# Altium schematic sheet Amp_op3.SchDoc: AmpOps de Potência
size A3; Address1: UFCG; Address2: Laboratório VIRTUS CC; Address3: Campina Grande, PB - Brasil; SheetNumber: 5; SheetTotal: 7; DocumentRev: 01; Project: HAT RPi 4 - Phase Shifter Fotônico; SCH_SCALE: N/A; Version: v1.0
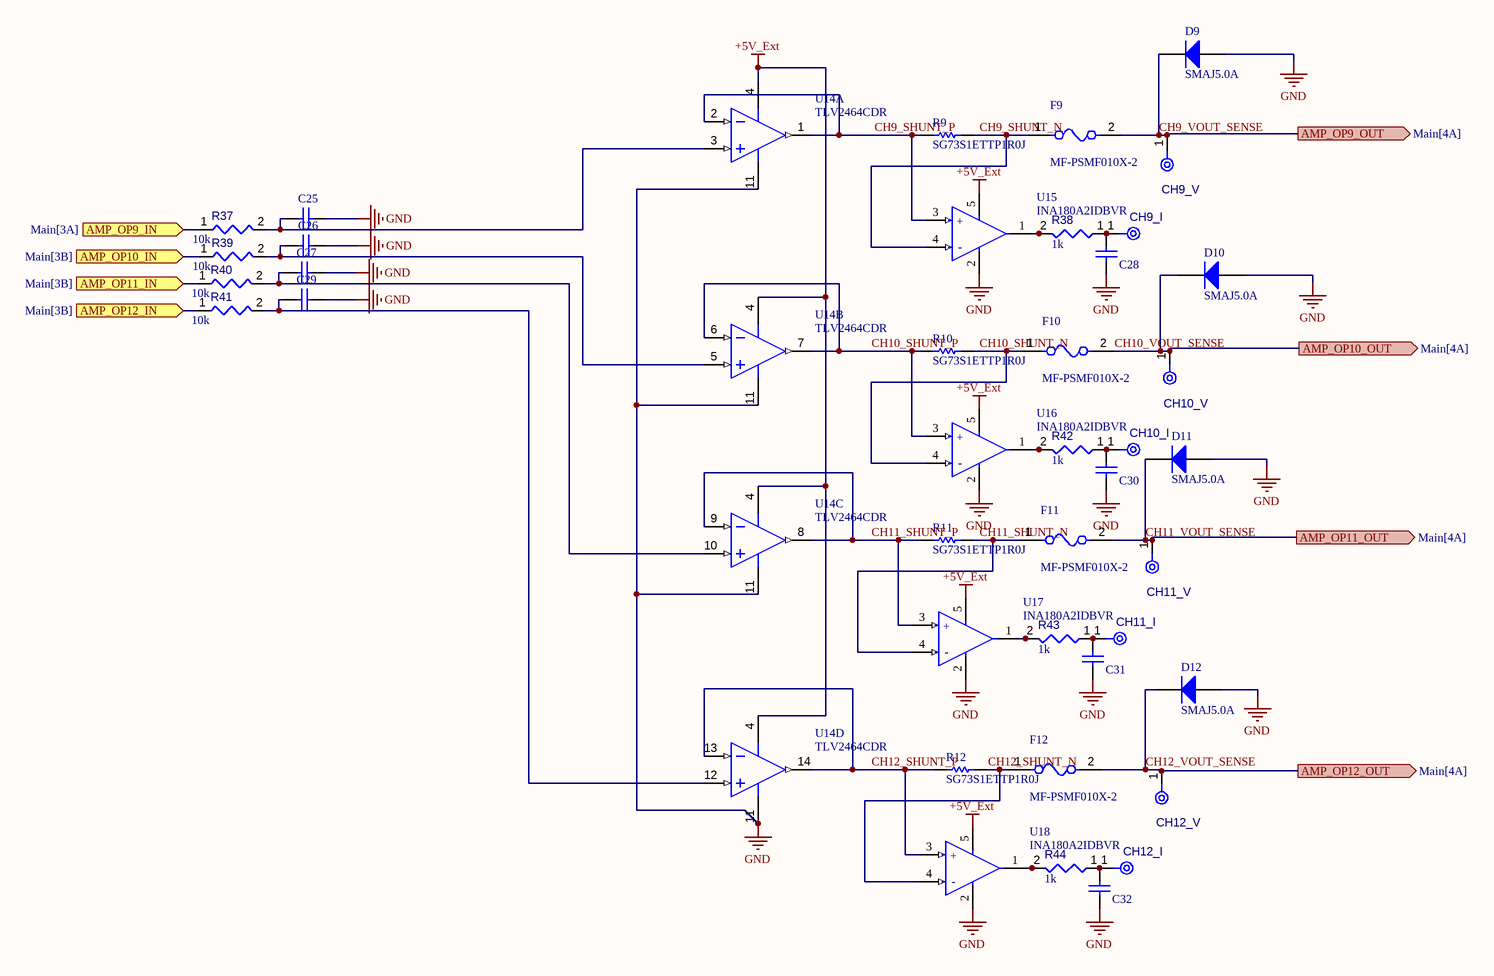
[diagram p0: Amp_op3.SchDoc]

## Parts
C25  VJ0603Y104MXJCW1BC  [CAPC1608X95X40NL15T15]  (value not drawn)
C26  VJ0603Y104MXJCW1BC  [CAPC1608X95X40NL15T15]  (value not drawn)
C27  VJ0603Y104MXJCW1BC  [CAPC1608X95X40NL15T15]  (value not drawn)
C28  VJ0603Y104MXJCW1BC  [CAPC1608X95X40NL15T15]  (value not drawn)
C29  VJ0603Y104MXJCW1BC  [CAPC1608X95X40NL15T15]  (value not drawn)
C30  VJ0603Y104MXJCW1BC  [CAPC1608X95X40NL15T15]  (value not drawn)
C31  VJ0603Y104MXJCW1BC  [CAPC1608X95X40NL15T15]  (value not drawn)
C32  VJ0603Y104MXJCW1BC  [CAPC1608X95X40NL15T15]  (value not drawn)
CH9_I  TPAD6R  [TP06R]  (value not drawn)  (no BOM)
CH9_V  TPAD6R  [TP06R]  (value not drawn)  (no BOM)
CH10_I  TPAD6R  [TP06R]  (value not drawn)  (no BOM)
CH10_V  TPAD6R  [TP06R]  (value not drawn)  (no BOM)
CH11_I  TPAD6R  [TP06R]  (value not drawn)  (no BOM)
CH11_V  TPAD6R  [TP06R]  (value not drawn)  (no BOM)
CH12_I  TPAD6R  [TP06R]  (value not drawn)  (no BOM)
CH12_V  TPAD6R  [TP06R]  (value not drawn)  (no BOM)
D9  SMAJ5.0A  [BOUR-SMA-2_V]
D10  SMAJ5.0A  [BOUR-SMA-2_V]
D11  SMAJ5.0A  [BOUR-SMA-2_V]
D12  SMAJ5.0A  [BOUR-SMA-2_V]
F9  MF-PSMF010X-2  [FP-MF-PSMF-MFG]
F10  MF-PSMF010X-2  [FP-MF-PSMF-MFG]
F11  MF-PSMF010X-2  [FP-MF-PSMF-MFG]
F12  MF-PSMF010X-2  [FP-MF-PSMF-MFG]
R9  SG73S1ETTP1R0J  [RESC1005X40X25LL10T10]
R10  SG73S1ETTP1R0J  [RESC1005X40X25LL10T10]
R11  SG73S1ETTP1R0J  [RESC1005X40X25LL10T10]
R12  SG73S1ETTP1R0J  [RESC1005X40X25LL10T10]
R37  value 10k  [RESC0603(1608)_L]  (hidden comment: Resistor 10k +/-1% 0603 100 mW)
R38  value 1k  [RESC0603(1608)_L]  (hidden comment: Resistor 1k +/-1% 0603 100 mW)
R39  value 10k  [RESC0603(1608)_L]  (hidden comment: Resistor 10k +/-1% 0603 100 mW)
R40  value 10k  [RESC0603(1608)_L]  (hidden comment: Resistor 10k +/-1% 0603 100 mW)
R41  value 10k  [RESC0603(1608)_L]  (hidden comment: Resistor 10k +/-1% 0603 100 mW)
R42  value 1k  [RESC0603(1608)_L]  (hidden comment: Resistor 1k +/-1% 0603 100 mW)
R43  value 1k  [RESC0603(1608)_L]  (hidden comment: Resistor 1k +/-1% 0603 100 mW)
R44  value 1k  [RESC0603(1608)_L]  (hidden comment: Resistor 1k +/-1% 0603 100 mW)
U14  TLV2464CDR  [D0014A_N]  (parts A,B,C,D of 4)
U15  INA180A2IDBVR  [FP-DBV0005A-MFG]
U16  INA180A2IDBVR  [FP-DBV0005A-MFG]
U17  INA180A2IDBVR  [FP-DBV0005A-MFG]
U18  INA180A2IDBVR  [FP-DBV0005A-MFG]

## Ports
AMP_OP9_IN (in, see Main[3A]), AMP_OP9_OUT (out, see Main[4A]), AMP_OP10_IN (in, see Main[3B]), AMP_OP10_OUT (out, see Main[4A]), AMP_OP11_IN (in, see Main[3B]), AMP_OP11_OUT (out, see Main[4A]), AMP_OP12_IN (in, see Main[3B]), AMP_OP12_OUT (out, see Main[4A])

## Nets
+5V_Ext: U14.4(VDD+) U15.5(VS) U16.5(VS) U17.5(VS) U18.5(VS)
GND: C25.2 C26.2 C27.2 C28.2 C29.2 C30.2 C31.2 C32.2 D9.1(A) D10.1(A) D11.1(A) D12.1(A) U14.11(GND) U15.2(GND) U16.2(GND) U17.2(GND) U18.2(GND)
AMP_OP9_IN: R37.1 ; port AMP_OP9_IN
AMP_OP10_IN: R39.1 ; port AMP_OP10_IN
AMP_OP11_IN: R40.1 ; port AMP_OP11_IN
AMP_OP12_IN: R41.1 ; port AMP_OP12_IN
CH9_SHUNT_N: F9.1 R9.2 U15.4(IN-)
CH9_SHUNT_P: R9.1 U14.1(OUT1) U14.2(IN1-) U15.3(IN+)
CH9_VOUT_SENSE: CH9_V.1(TP) D9.2(K) F9.2 ; port AMP_OP9_OUT
CH10_SHUNT_N: F10.1 R10.2 U16.4(IN-)
CH10_SHUNT_P: R10.1 U14.6(IN2-) U14.7(OUT2) U16.3(IN+)
CH10_VOUT_SENSE: CH10_V.1(TP) D10.2(K) F10.2 ; port AMP_OP10_OUT
CH11_SHUNT_N: F11.1 R11.2 U17.4(IN-)
CH11_SHUNT_P: R11.1 U14.8(OUT3) U14.9(IN3-) U17.3(IN+)
CH11_VOUT_SENSE: CH11_V.1(TP) D11.2(K) F11.2 ; port AMP_OP11_OUT
CH12_SHUNT_N: F12.1 R12.2 U18.4(IN-)
CH12_SHUNT_P: R12.1 U14.13(IN4-) U14.14(OUT4) U18.3(IN+)
CH12_VOUT_SENSE: CH12_V.1(TP) D12.2(K) F12.2 ; port AMP_OP12_OUT
NetC25_1: C25.1 R37.2 U14.3(IN1+)
NetC26_1: C26.1 R39.2 U14.5(IN2+)
NetC27_1: C27.1 R40.2 U14.10(IN3+)
NetC28_1: C28.1 CH9_I.1(TP) R38.1
NetC29_1: C29.1 R41.2 U14.12(IN4+)
NetC30_1: C30.1 CH10_I.1(TP) R42.1
NetC31_1: C31.1 CH11_I.1(TP) R43.1
NetC32_1: C32.1 CH12_I.1(TP) R44.1
NetR38_2: R38.2 U15.1(OUT)
NetR42_2: R42.2 U16.1(OUT)
NetR43_2: R43.2 U17.1(OUT)
NetR44_2: R44.2 U18.1(OUT)

## Notes on the sheet
- REVISION
- DESCRIPTION
- DATE
- APPROVED
- ADDRESS
- PROJECT
- VERSION
- TITLE
- A3
- SIZE
- SCALE
- DOCUMENT NAME:
- DOCUMENT REVISION:
- OF
- SHEET:
- PROJECT REVISION:
- (in symbol CMP-04895-000287-1) +; -

## Library data of the parts
C25-C32 = CMP-2006-00058-1: Manufacturer: Vitramon; Part Number: VJ0603Y104MXJCW1BC
CH9_I CH9_V CH10_I CH10_V CH11_I CH11_V CH12_I CH12_V = CMP-00028-00002-2: 0.6mm round; Pins: 1; Component Type: Mechanical
D9-D12 = CMP-2000-07090-1: SMAJ Transient Voltage Suppressor Diode Series, 3.5 V, -55 to 150 degC, 2-Pin SMA, RoHS, Tape and Reel; Manufacturer: Bourns; EDA / CAD Models: DownloadfromAcceleratedDesigns; Unidirectional Channels: 1; Voltage - Breakdown (Min): 6.4V; Voltage - Reverse Standoff (Typ): 5V; Voltage - Clamping (Max) @ Ipp: 9.2V; Other Names: SMAJ5.0ABDKR; Type: Zener; Catalog Drawings: SMAJSeriesFootprintSMAJ,SMBJSeries; Featured Product: SMAJ/SMBJ/SMCJ/SMLJDiscreteTVSDiodes; Power - Peak Pulse: 400W; Current - Peak Pulse (10/1000µs): 43.5A; Power Line Protection: No; Online Catalog: SMAJSeries; Supplier Device Package: SMA(DO-214AC); Operating Temperature: -55°C~150°C(TJ); Package Description: 2-Pin Surface Mount Device, Body 4.315 x 2.605 mm; Datasheet URL: https://datasheet.ciiva.com/25624/0900766b8112213b-25624680.pdf; Manufacturer URL: http://www.bourns.com/; Datasheet Version: 08/2012; Series: SMAJ; Family: TVS-Diodes; Bidirectional Channels: -; Applications: GeneralPurpose; Package Reference: SMA-2; Standard Package: 1; Package / Case: DO-214AC,SMA; Category: CircuitProtection; RoHS Information: SMAJSeriesMaterialDeclaration; Mounting Technology: SurfaceMount; Capacitance @ Frequency: -; Packaging: Digi-Reel®; Mounting Type: SurfaceMount
F9-F12 = CMP-07400-000017-1: PTC RESET FUSE 15V 100MA 0805; Manufacturer: Bourns Inc.; Resistance: 1-7.5Ω; Value: 1-7.5Ω; Current Rating: 40A; Hold Current: 0.1A; Trip Current: 0.3A; Trip Time: 1.5s; Temperature: -40°C to +85°C; ComponentLink2Description: Datasheet; Lead Free: Yes; Ipc Land Pattern Name: CAPC215135X67; Device Class L1: Circuit Protection; Mouser Description: Resettable Fuses - PPTC 0.10A 15V 1ohm; Automotive: No; Octopart: https://octopart.com/mf-psmf010x-2-bourns-7483441; Manufacturer Part Number: MF-PSMF010X-2; RoHS: TRUE; Temperature Range High: +85°C; Digikey Description: PTC RESET FUSE 15V 100MA 0805; Device Class L3: unset; ComponentLink2URL: https://www.bourns.com/docs/Product-Datasheets/mfpsmf.pdf; Height: 0.85mm; Voltage Rating: 15V; Ambient Temperature Range Low: -40°C; Category: Fuse; Package: MF-PSMF; Temperature Range Low: -40°C; Device Class L2: PTC Resettable Fuses; Ambient Temperature Range High: +85°C
R9-R12 = CMP-2002-04124-1: Manufacturer: KOA Speer; Part Number: SG73S1ETTP1R0J
R37 R39-R41 = CMP-009-00017-7: Chip Resistor, 10 KOhm, +/- 1%, 01 W, -55 to 155 degC, 0603 (1608 Metric); Manufacturer: Vishay; Manufacturer Part Number: CRCW060310K0FKEA; Voltage Rating: 50V; Power: 100mW; RoHS Compliant: True; Min Operating Temperature: -55°C; Pins: 2; Case/Package: 0603; Mounting Technology: SM; Max Operating Temperature: 155°C; Tolerance: 1%; Component Type: Resistors
R38 R42-R44 = CMP-009-00014-6: Chip Resistor, 1 KOhm, +/-1%, 0.1 W, -55 to 155 degC, 0603 (1608 Metric); Manufacturer: Yageo; Manufacturer Part Number: RC0603FR-131KL; Power: 100mW; Tolerance: 1%; Voltage Rating: 50V; Mounting Technology: SM; Case/Package: 0603; Min Operating Temperature: -55°C; RoHS Compliant: True; Max Operating Temperature: 155°C; Pins: 2; Component Type: Resistors
U14 = CMP-0271-00006-3: Quad Low Power, Rail-to-Rail Input / Output Operational Amplifier, 2.7 to 6 V, 0 to 70 degC, 14-pin SOIC (D14), Green (RoHS & no Sb/Br); Manufacturer: Texas Instruments; Offset Drift(Typ)(uV/C): 2; Total Supply Voltage(Min)(+5V is 5, +/-5V is 10): 2.7; IIB(Max)(pA): 14000; CMRR(Min)(dB): 66; Iq per channel(Max)(mA): 0.575; Vn at 1kHz(Typ)(nV/rtHz): 11; Slew Rate(Typ)(V/us): 1.6; Number of Channels: 4; Sub Family: High Output Current Amplifier (>=50mA), Low Supply Voltage Amplifier (<=2.7V), Precision Amplifier; Total Supply Voltage(Max)(+5V is 5, +/-5V is 10): 6; ComponentLink3URL: http://www.ti.com/lit/ml/mpds177g/mpds177g.pdf; ComponentLink1Description: Manufacturer URL; PackageReference: D0014A; Vio (25C)(Max)(mV): 2; Mounting Technology: Surface Mount; PackageDescription: 14-Pin Plastic Small Outline, Body 8.65 x 3.9 mm, Pitch 1.27 mm; ComponentLink2Description: Datasheet; ComponentLink3Description: Package Specification; ComponentLink1URL: http://www.ti.com/; DatasheetVersion: SLOS220J; PartNumber: TLV2464CDR; Code_JEDEC: MS-012; PackageVersion: 4040047-5/M, 06/2011; ComponentLink2URL: http://www.ti.com/general/docs/lit/getliterature.tsp?genericPartNumber=TLV2464&fileType=pdf; Eco-Plan: Green (RoHS & no Sb/Br)
U15-U18 = CMP-04895-000287-1: IC CURR SENSE 1 CIRCUIT SOT23-5; Operating Supply Current: 260uA; -3db Bandwidth: 350kHz; Slew Rate: 2V/µs; Number of Circuits: 1; Input Offset Voltage (Vos): 100uV; Input Bias Current: 100nA; Mount: Surface Mount; Max Operating Temperature: 125°C; Packaging: Tape and Reel; Min Operating Temperature: -40°C; Case/Package: SOT-23-5; RoHS Compliant: Yes